# Altium schematic sheet Modulebit_004.SchDoc
size A2; Author: Steve Wiseman; Organization: Arbury.com Ltd; Address1: 2 Durnford Way; Address2: Cambridge; Address3: CB4 2DP; Address4: Unted Kingdom; DocumentNumber: 1; SheetNumber: 1; SheetTotal: 1
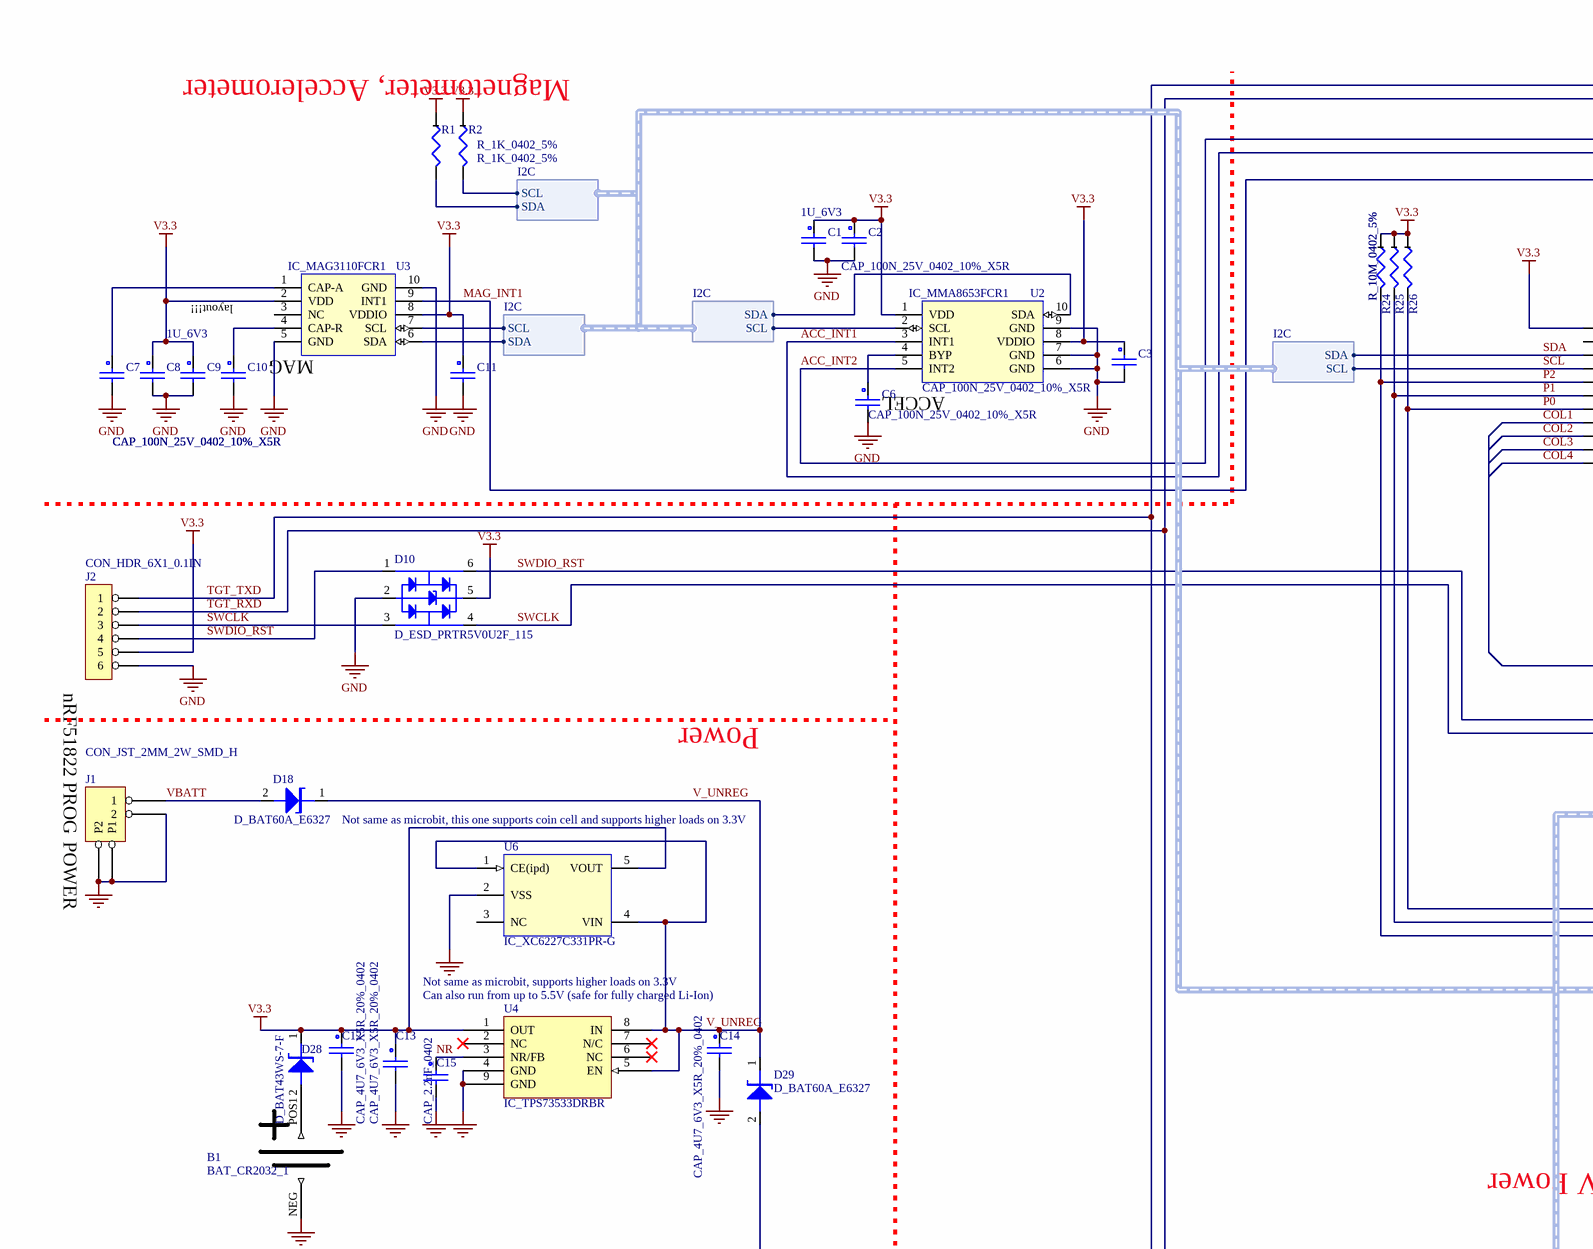
[diagram p0: Modulebit_004.SchDoc, top left]
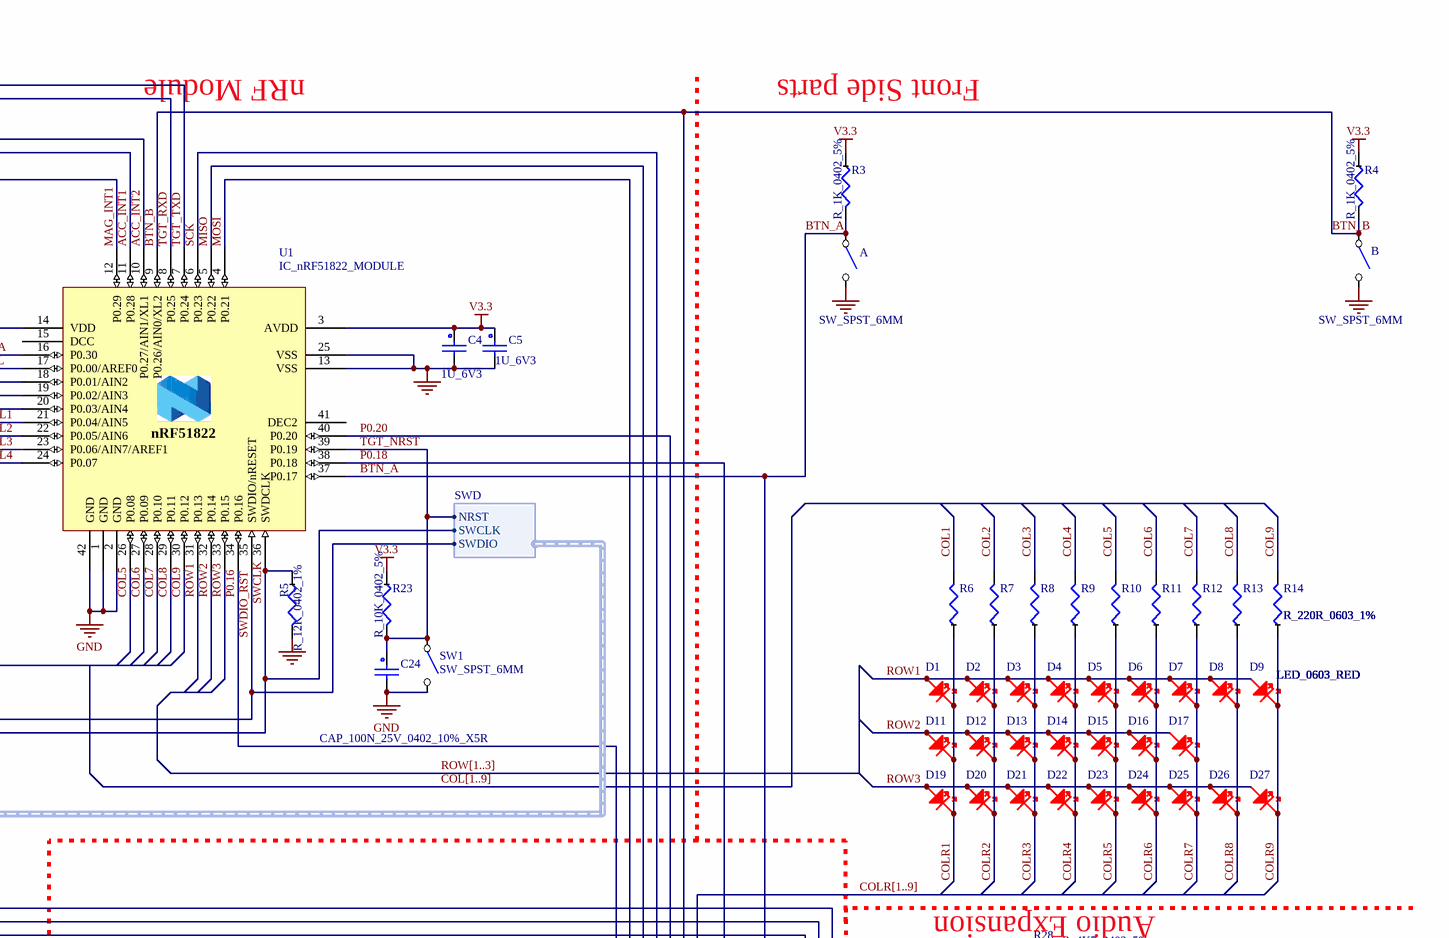
[diagram p1: Modulebit_004.SchDoc, top right]
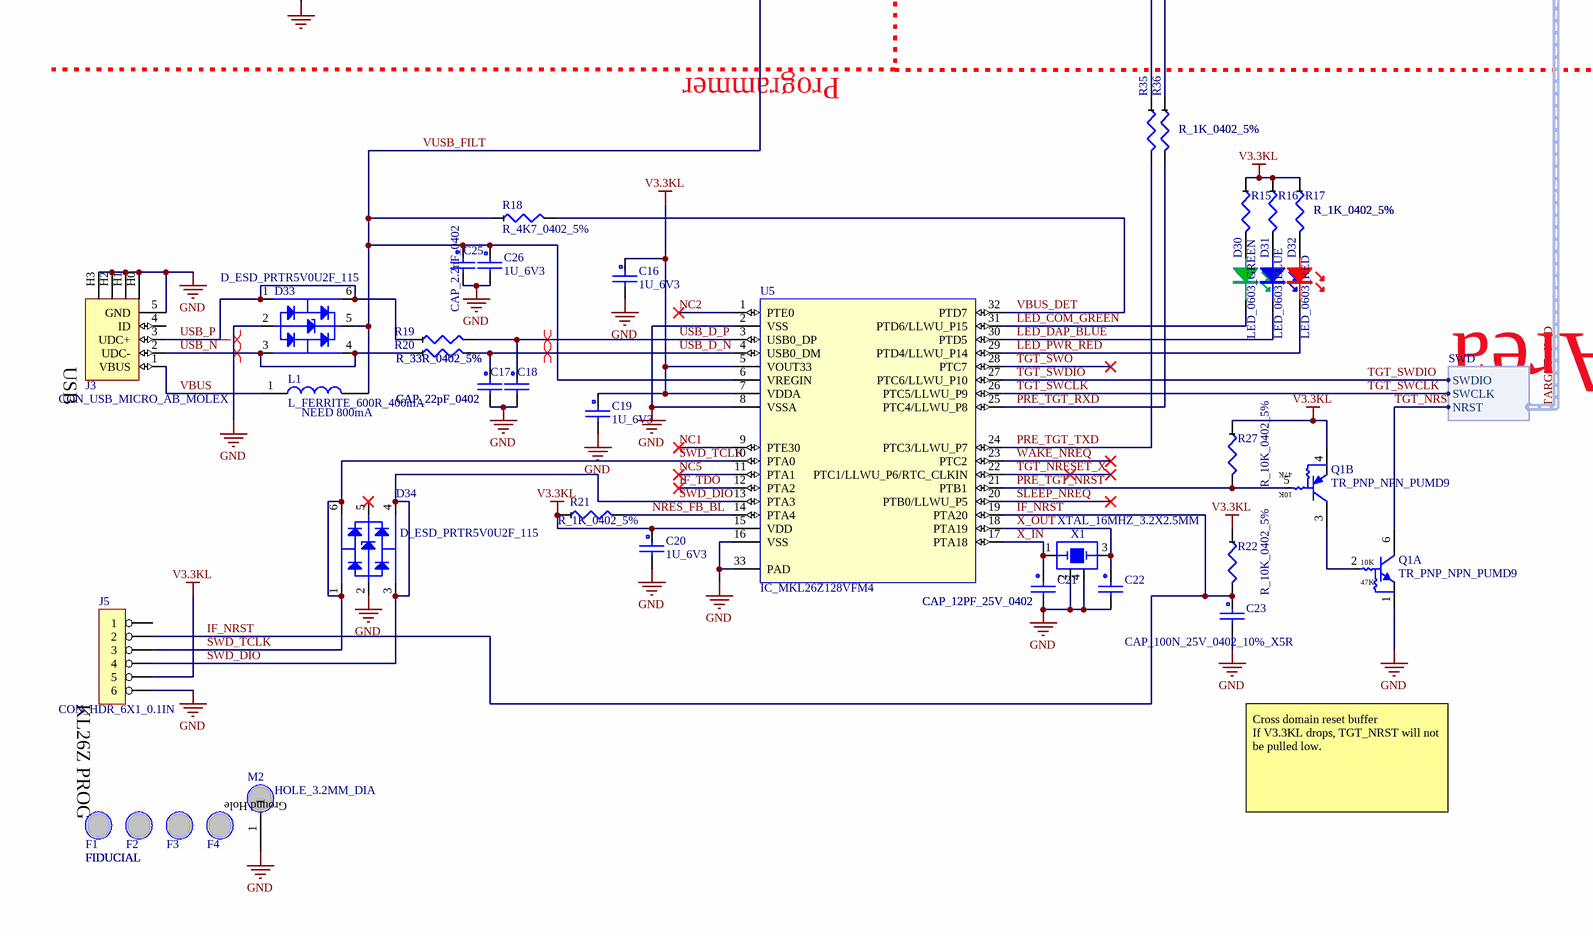
[diagram p2: Modulebit_004.SchDoc, bottom left]
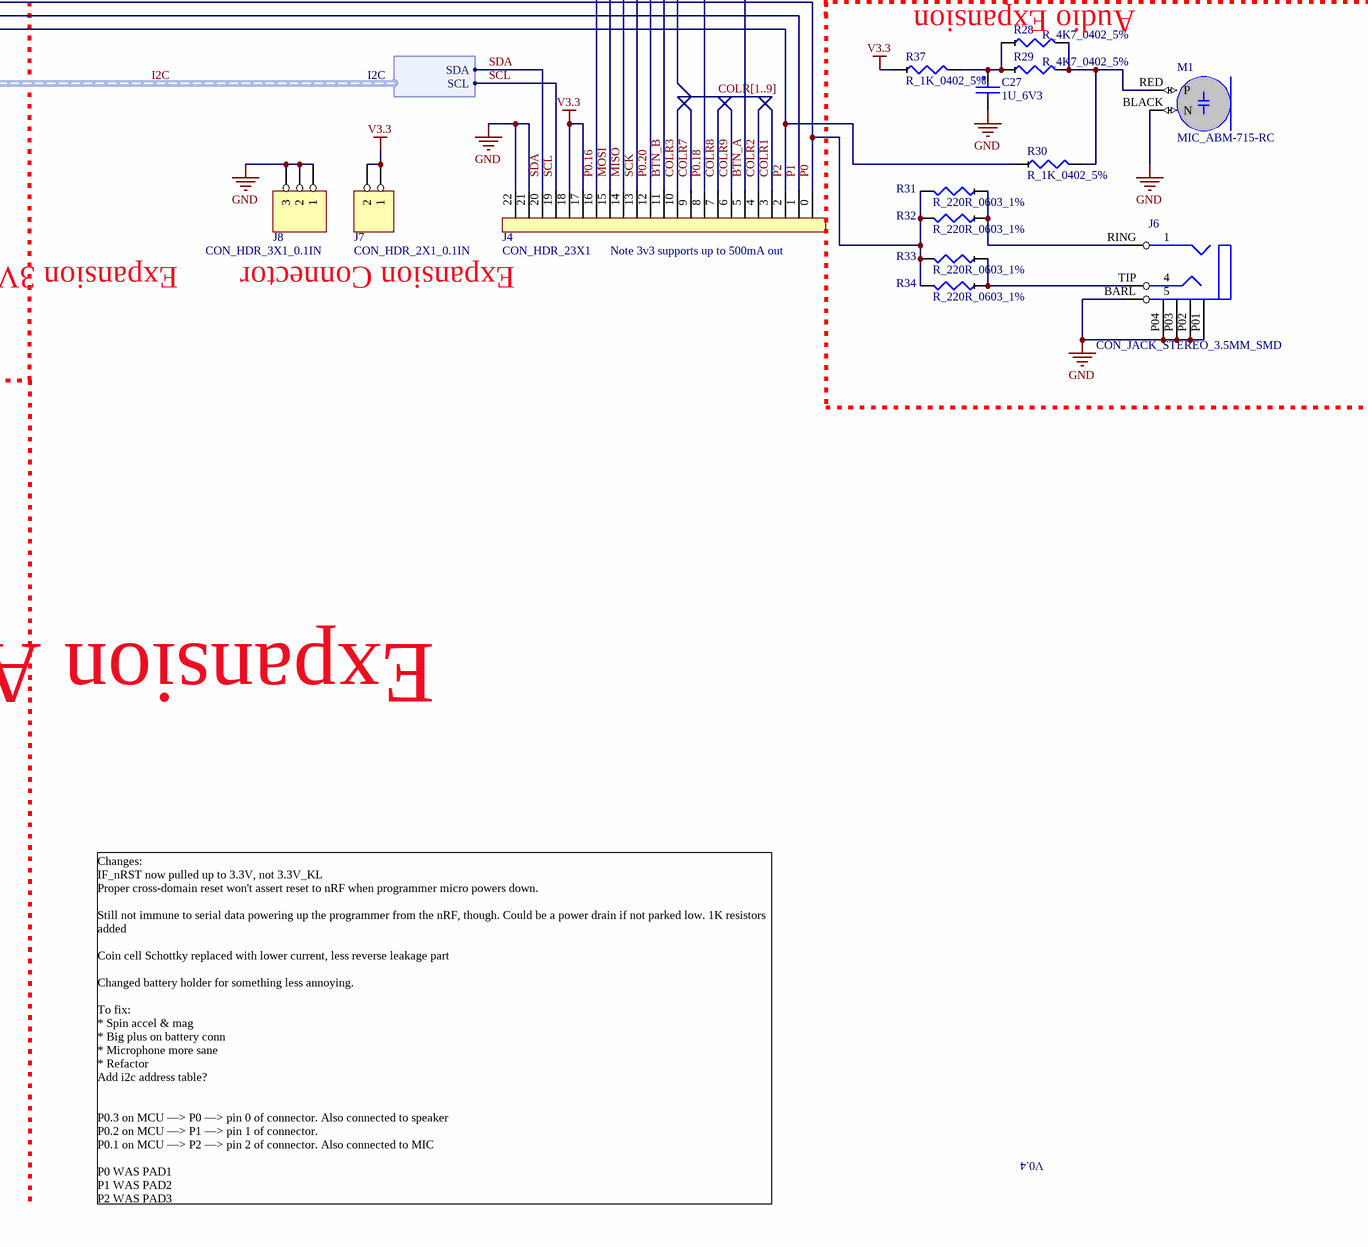
[diagram p3: Modulebit_004.SchDoc, bottom right]

## Parts
A  SW_SPST_6MM  [SW_FSM4JSMA]
B  SW_SPST_6MM  [SW_FSM4JSMA]
B1  BAT_CR2032_1  [BAT_CR2032_CH7410-2032LF]
C1  1U_6V3  [C_0402]
C2  CAP_100N_25V_0402_10%_X5R  [C_0402]
C3  CAP_100N_25V_0402_10%_X5R  [C_0402]
C4  1U_6V3  [C_0402]
C5  1U_6V3  [C_0402]
C6  CAP_100N_25V_0402_10%_X5R  [C_0402]
C7  CAP_100N_25V_0402_10%_X5R  [C_0402]
C8  1U_6V3  [C_0402]
C9  CAP_100N_25V_0402_10%_X5R  [C_0402]
C10  CAP_100N_25V_0402_10%_X5R  [C_0402]
C11  CAP_100N_25V_0402_10%_X5R  [C_0402]
C12  CAP_4U7_6V3_X5R_20%_0402  [c_0402]
C13  CAP_4U7_6V3_X5R_20%_0402  [c_0402]
C14  CAP_4U7_6V3_X5R_20%_0402  [c_0402]
C15  CAP_2.2nF_0402  [C_0402]
C16  1U_6V3  [C_0402]
C17  CAP_22pF_0402  [c_0402]
C18  CAP_22pF_0402  [c_0402]
C19  1U_6V3  [C_0402]
C20  1U_6V3  [C_0402]
C21  CAP_12PF_25V_0402  [C_0402]
C22  CAP_12PF_25V_0402  [C_0402]
C23  CAP_100N_25V_0402_10%_X5R  [C_0402]
C24  CAP_100N_25V_0402_10%_X5R  [C_0402]
C25  CAP_2.2nF_0402  [C_0402]
C26  1U_6V3  [C_0402]
C27  1U_6V3  [C_0402]
D1  LED_0603_RED  [LED_0603_RED]
D2  LED_0603_RED  [LED_0603_RED]
D3  LED_0603_RED  [LED_0603_RED]
D4  LED_0603_RED  [LED_0603_RED]
D5  LED_0603_RED  [LED_0603_RED]
D6  LED_0603_RED  [LED_0603_RED]
D7  LED_0603_RED  [LED_0603_RED]
D8  LED_0603_RED  [LED_0603_RED]
D9  LED_0603_RED  [LED_0603_RED]
D10  D_ESD_PRTR5V0U2F_115  [SOT886]
D11  LED_0603_RED  [LED_0603_RED]
D12  LED_0603_RED  [LED_0603_RED]
D13  LED_0603_RED  [LED_0603_RED]
D14  LED_0603_RED  [LED_0603_RED]
D15  LED_0603_RED  [LED_0603_RED]
D16  LED_0603_RED  [LED_0603_RED]
D17  LED_0603_RED  [LED_0603_RED]
D18  D_BAT60A_E6327  [SOD323]
D19  LED_0603_RED  [LED_0603_RED]
D20  LED_0603_RED  [LED_0603_RED]
D21  LED_0603_RED  [LED_0603_RED]
D22  LED_0603_RED  [LED_0603_RED]
D23  LED_0603_RED  [LED_0603_RED]
D24  LED_0603_RED  [LED_0603_RED]
D25  LED_0603_RED  [LED_0603_RED]
D26  LED_0603_RED  [LED_0603_RED]
D27  LED_0603_RED  [LED_0603_RED]
D28  D_BAT43WS-7-F  [SOD323]
D29  D_BAT60A_E6327  [SOD323]
D30  LED_0603_GREEN  [LED_0603_GREEN]
D31  LED_0603_BLUE  [LED_0603_BLUE]
D32  LED_0603_RED  [LED_0603_RED]
D33  D_ESD_PRTR5V0U2F_115  [SOT886]
D34  D_ESD_PRTR5V0U2F_115  [SOT886]
F1  FIDUCIAL  [FIDUCIAL_OV]
F2  FIDUCIAL  [FIDUCIAL_OV]
F3  FIDUCIAL  [FIDUCIAL_OV]
F4  FIDUCIAL  [FIDUCIAL_OV]
J1  CON_JST_2MM_2W_SMD_H  [CON_JST_S2B-PH-SM4-TB]
J2  CON_HDR_6X1_0.1IN  [CON_HDR_6X1]
J3  CON_USB_MICRO_AB_MOLEX  [CON_USB_MICRO_AB_MOLEX]
J4  CON_HDR_23X1  [CON_HDR_23X1]
J5  CON_HDR_6X1_0.1IN  [CON_HDR_6X1]
J6  CON_JACK_STEREO_3.5MM_SMD  [CON_JACK_STEREO_3.5MM_SMT]
J7  CON_HDR_2X1_0.1IN  [CON_HDR_2X1]
J8  CON_HDR_3X1_0.1IN  [CON_HDR_3X1]
L1  L_FERRITE_600R_400mA  [L_0603]
M1  MIC_ABM-715-RC  [MIC_ABM-715-RC]
M2  HOLE_3.2MM_DIA  [HOLE_3.2MM_DIA]  (no BOM)
Q1  TR_PNP_NPN_PUMD9  [SOT363_N]  (parts A,B of 2)
R1  R_1K_0402_5%  [R_0402]
R2  R_1K_0402_5%  [R_0402]
R3  R_1K_0402_5%  [R_0402]
R4  R_1K_0402_5%  [R_0402]
R5  R_12K_0402_1%  [R_0402]
R6  R_220R_0603_1%  [R_0603]
R7  R_220R_0603_1%  [R_0603]
R8  R_220R_0603_1%  [R_0603]
R9  R_220R_0603_1%  [R_0603]
R10  R_220R_0603_1%  [R_0603]
R11  R_220R_0603_1%  [R_0603]
R12  R_220R_0603_1%  [R_0603]
R13  R_220R_0603_1%  [R_0603]
R14  R_220R_0603_1%  [R_0603]
R15  R_1K_0402_5%  [R_0402]
R16  R_1K_0402_5%  [R_0402]
R17  R_1K_0402_5%  [R_0402]
R18  R_4K7_0402_5%  [R_0402]
R19  R_33R_0402_5%  [R_0402]
R20  R_33R_0402_5%  [R_0402]
R21  R_1K_0402_5%  [R_0402]
R22  R_10K_0402_5%  [R_0402]
R23  R_10K_0402_5%  [R_0402]
R24  R_10M_0402_5%  [R_0402]
R25  R_10M_0402_5%  [R_0402]
R26  R_10M_0402_5%  [R_0402]
R27  R_10K_0402_5%  [R_0402]
R28  R_4K7_0402_5%  [R_0402]
R29  R_4K7_0402_5%  [R_0402]
R30  R_1K_0402_5%  [R_0402]
R31  R_220R_0603_1%  [R_0603]
R32  R_220R_0603_1%  [R_0603]
R33  R_220R_0603_1%  [R_0603]
R34  R_220R_0603_1%  [R_0603]
R35  R_1K_0402_5%  [R_0402]
R36  R_1K_0402_5%  [R_0402]
R37  R_1K_0402_5%  [R_0402]
SW1  SW_SPST_6MM  [SW_FSM4JSMA]
U1  IC_nRF51822_MODULE  [IC_nRF51822_MODULE_PASTE]
U2  IC_MMA8653FCR1  [IC_QFN40P200X200X85-10M]
U3  IC_MAG3110FCR1  [IC_QFN40P200X200X85-10M]
U4  IC_TPS73533DRBR  [IC_QFN65P300X300X100-8M-TI]
U5  IC_MKL26Z128VFM4  [IC_QFN50P500X500X100-32N]
U6  IC_XC6227C331PR-G  [SOT895]
X1  XTAL_16MHZ_3.2X2.5MM  [XTAL_3.2X2.5MM]

## Harnesses
SWD: SWDIO, SWCLK, NRST
I2C: SCL, SDA

## Nets
GND: A.2 B.2 B1.NEG C1.2 C2.2 C3.2 C4.2 C5.2 C6.2 C7.2 C8.2 C9.2 C10.2 C11.2 C12.2 C13.2 C14.2 C15.2 C16.2 C17.2 C18.2 C19.2 C20.2 C21.2 C22.2 C23.2 C24.2 C25.2 C26.2 C27.2 D10.2 D33.2 D34.2 J1.2 J1.P1 J1.P2 J2.6 J3.5(GND) J3.H0 J3.H1 J3.H2 J3.H3 J4.21 J4.22 J5.6 J6.BARL J6.P01 J6.P02 J6.P03 J6.P04 J8.1 J8.2 J8.3 M1.BLACK(N) M2.1 Q1.1(E) R5.2 SW1.2 U1.1(GND) U1.2(GND) U1.13(VSS) U1.25(VSS) U1.42(GND) U2.6(GND) U2.7(GND) U2.9(GND) U3.5(GND) U3.10(GND) U4.4(GND) U4.9(GND) U5.2(VSS) U5.8(VSSA) U5.16(VSS) U5.33(PAD) U6.2(VSS) X1.2(G2) X1.4(G4)
V3.3: C1.1 C2.1 C3.1 C4.1 C5.1 C8.1 C9.1 C11.1 C12.1 C13.1 D10.5 D28.1(K) J2.5 J4.17 J4.18 J7.1 J7.2 R1.1 R2.1 R3.1 R4.1 R23.1 R24.1 R25.1 R26.1 R37.1 U1.3(AVDD) U1.14(VDD) U2.1(VDD) U2.8(VDDIO) U3.2(VDD) U3.8(VDDIO) U4.1(OUT) U6.5(VOUT)
V3.3KL: C16.1 C19.1 C20.1 J5.5 Q1.4(E) R15.1 R16.1 R17.1 R21.1 R22.1 R27.1 U5.5(VOUT33) U5.7(VDDA) U5.15(VDD)
ACC_INT1: U1.11(P0.28) U2.3(INT1)
ACC_INT2: U1.10(P0.27/AIN1/XL1) U2.5(INT2)
BTN_A: A.1 J4.5 R3.2 U1.37(P0.17)
BTN_B: B.1 J4.11 R4.2 U1.9(P0.26/AIN0/XL2)
COL1: R6.2 U1.21(P0.04/AIN5)
COL2: R7.2 U1.22(P0.05/AIN6)
COL3: R8.2 U1.23(P0.06/AIN7/AREF1)
COL4: R9.2 U1.24(P0.07)
COL5: R10.2 U1.26(P0.08)
COL6: R11.2 U1.27(P0.09)
COL7: R12.2 U1.28(P0.10)
COL8: R13.2 U1.29(P0.11)
COL9: R14.2 U1.30(P0.12)
COLR1: D1.K D11.K D19.K J4.3 R6.1
COLR2: D2.K D12.K D20.K J4.4 R7.1
COLR3: D3.K D13.K D21.K J4.10 R8.1
COLR4: D4.K D14.K D22.K R9.1
COLR5: D5.K D15.K D23.K R10.1
COLR6: D6.K D16.K D24.K R11.1
COLR7: D7.K D17.K D25.K J4.9 R12.1
COLR8: D8.K D26.K J4.7 R13.1
COLR9: D9.K D27.K J4.6 R14.1
IF_NRST: C23.1 J5.2 R22.2 U5.19(PTA20)
IF_TDO: U5.12(PTA2)
LED_COM_GREEN: D30.K U5.31(PTD6/LLWU_P15)
LED_DAP_BLUE: D31.K U5.30(PTD5)
LED_PWR_RED: D32.K U5.29(PTD4/LLWU_P14)
MAG_INT1: U1.12(P0.29) U3.9(INT1)
MISO: J4.14 U1.5(P0.22)
MOSI: J4.15 U1.4(P0.21)
NC1: U5.9(PTE30)
NC2: U5.1(PTE0)
NC5: U5.11(PTA1)
NR: C15.1 U4.3(NR/FB)
NRES_FB_BL: R21.2 U5.14(PTA4)
P0: J4.0 R26.2 R31.2 R32.2 R33.2 R34.2 U1.20(P0.03/AIN4)
P0.16: J4.16 U1.34(P0.16)
P0.18: J4.8 U1.38(P0.18)
P0.20: J4.12 U1.40(P0.20)
P1: J4.1 R25.2 U1.19(P0.02/AIN3)
P2: J4.2 R24.2 R30.1 U1.18(P0.01/AIN2)
PRE_TGT_NRST: Q1.5(B) R27.2 U5.21(PTB1)
PRE_TGT_RXD: R36.2 U5.25(PTC4/LLWU_P8)
PRE_TGT_TXD: R35.2 U5.24(PTC3/LLWU_P7)
ROW1: D1.A D2.A D3.A D4.A D5.A D6.A D7.A D8.A D9.A U1.31(P0.13)
ROW2: D11.A D12.A D13.A D14.A D15.A D16.A D17.A U1.32(P0.14)
ROW3: D19.A D20.A D21.A D22.A D23.A D24.A D25.A D26.A D27.A U1.33(P0.15)
SCK: J4.13 U1.6(P0.23)
SCL: J4.19 R2.2 U1.17(P0.00/AREF0) U2.2(SCL) U3.7(SCL) ; harness I2C.SCL  [project net I2C.SCL]
SDA: J4.20 R1.2 U1.16(P0.30) U2.10(SDA) U3.6(SDA) ; harness I2C.SDA  [project net I2C.SDA]
SLEEP_NREQ: U5.20(PTB0/LLWU_P5)
SWCLK: D10.3 D10.4 J2.3 R5.1 U1.36(SWDCLK) U5.26(PTC5/LLWU_P9) ; harness SWD.SWCLK  [also labelled TGT_SWCLK]
SWD_DIO: D34.3 D34.4 J5.4 U5.13(PTA3)
SWD_TCLK: D34.1 D34.6 J5.3 U5.10(PTA0)
SWDIO_RST: D10.1 D10.6 J2.4 U1.35(SWDIO/nRESET) U5.27(PTC6/LLWU_P10) ; harness SWD.SWDIO  [also labelled TGT_SWDIO]
TGT_NRESET_X: U5.22(PTC1/LLWU_P6/RTC_CLKIN)
TGT_NRST: C24.1 Q1.6(C) R23.2 SW1.1 U1.39(P0.19) ; harness SWD.NRST  [project net TARGET_SWD.NRST]
TGT_RXD: J2.2 R36.1 U1.8(P0.25)
TGT_SWO: U5.28(PTC7)
TGT_TXD: J2.1 R35.1 U1.7(P0.24)
USB_D_N: C17.1 R20.2 U5.4(USB0_DM)
USB_D_P: C18.1 R19.2 U5.3(USB0_DP)
USB_N: D33.3 D33.4 J3.2(UDC-) R20.1
USB_P: D33.1 D33.6 J3.3(UDC+) R19.1
V_UNREG: C14.1 D18.1(K) D29.1(K) U4.5(EN) U4.8(IN) U6.1(CE(ipd)) U6.4(VIN)
VBATT: D18.2(A) J1.1
VBUS: J3.1(VBUS) L1.1
VBUS_DET: R18.2 U5.32(PTD7)
VUSB_FILT: C25.1 C26.1 D29.2(A) D33.5 L1.2 R18.1 U5.6(VREGIN)
WAKE_NREQ: U5.23(PTC2)
X_IN: C21.1 U5.17(PTA18) X1.1(X1)
X_OUT: C22.1 U5.18(PTA19) X1.3(X3)
NetB1_POS1: B1.POS1 D28.2(A)
NetC6_1: C6.1 U2.4(BYP)
NetC7_1: C7.1 U3.1(CAP-A)
NetC10_1: C10.1 U3.4(CAP-R)
NetC27_1: C27.1 R28.1 R29.1 R37.2
NetD30_A: D30.A R15.2
NetD31_A: D31.A R16.2
NetD32_A: D32.A R17.2
NetJ6_RING: J6.RING R31.1 R32.1
NetJ6_TIP: J6.TIP R33.1 R34.1
NetM1_RED: M1.RED(P) R28.2 R29.2 R30.2
NetQ1_2: Q1.2(B) Q1.3(C)

Not connected (* = marked no-connect by the designer): D34 5*; F1 1; F2 1; F3 1; F4 1; J3 4(ID); J5 1; U1 15(DCC) 41(DEC2); U3 3(NC); U4 2(NC)* 6(NC)* 7(N/C)*; U6 3(NC)

## Buses and harness runs
bus COL[1..9]
bus COLR[1..9]
bus ROW[1..3]

## Layout directives
differential pair: USB_D_N, USB_D_P, USB_N, USB_P

## Notes on the sheet
- Magnetometer, Accelerometer
- nRF Module
- Front Side parts
- (near U3) layout!!!
- (near U3) MAG
- (near U2) ACCEL
- (near J2) nRF51822 PROG
- Power
- Not same as microbit, this one supports coin cell and supports higher loads on 3.3V
- (near J1) POWER
- Audio Expansion
- Not same as microbit, supports higher loads on 3.3V
- Can also run from up to 5.5V (safe for fully charged Li-Ion)
- Expansion 3V Power
- (near J4) Expansion Connector
- (near J4) Note 3v3 supports up to 500mA out
- Programmer
- Expansion Area
- (near J3) USB
- (near L1) NEED 800mA
- (near J5) KL26Z PROG
- (near M2) Ground Hole
- Cross domain reset buffer
  If V3.3KL drops, TGT_NRST will not be pulled low.
- Changes:
  IF_nRST now pulled up to 3.3V, not 3.3V_KL
  Proper cross-domain reset won't assert reset to nRF when programmer micro powers down.
  Still not immune to serial data powering up the programmer from the nRF, though. Could be a power drain if not parked low. 1K resistors added
  Coin cell Schottky replaced with lower current, less reverse leakage part
  Changed battery holder for something less annoying.
  To fix:
  * Spin accel & mag
  * Big plus on battery conn
  * Microphone more sane
  * Refactor
  Add i2c address table?
  P0.3 on MCU —> P0 —> pin 0 of connector. Also connected to speaker
  P0.2 on MCU —> P1 —> pin 1 of connector.
  P0.1 on MCU —> P2 —> pin 2 of connector. Also connected to MIC
  P0 WAS PAD1
  P1 WAS PAD2
  P2 WAS PAD3
- V0.4
- Title
- Cambridge Prototypes Ltd
- Size:
- Date:
- File:
- A2
- Number:
- Time:
- Revision:
- Sheet
- of
- 2 Durnford Way
- Cambridge
- CB4 2DP
- (in symbol CON_JACK_STEREO_3.5MM_SMD) 1; 4; 5
- (in symbol IC_nRF51822_MODULE) nRF51822
- (in symbol TR_PNP_NPN_PUMD9, part A) 10K; 47K
- (in symbol TR_PNP_NPN_PUMD9, part B) 47K; 10K

## Library data of the parts
A B SW1 = SW_SPST_6MM: SPST SWITCH 6MM; PART: FSM4JSMA; MANUFACTURER: TE CONNECTIVITY / ALCOSWITCH; FARNELL: 3801305
B1 = BAT_CR2032_1: CR2032 battery in holder; PART: CH7410-2032LF; MANUFACTURER: Takachi Electric Industrial; RS: 239-592; FARNELL: 2064724
C1 C4 C5 C8 C16 C19 C20 C26 C27 = CAP_1u_6V3_0402_10%_X6S: MANUFACTURER: YAGEO; PART: CC0402KRX7R7BB104; FARNELL: 9402047RL; MOUSER: 603-CC402KRX7R7BB104; DIGIKEY: 311-1338-6-ND
C2 C3 C6 C7 C9-C11 C23 C24 = CAP_100N_25V_0402_10%_X5R: PART: TMK105BJ104KV-F; MANUFACTURER: TAIYO YUDEN; FARNELL: 1611916
C12-C14 = CAP_4U7_6V3_X5R_20%_0402: PART: C1005X5R0J475M; MANUFACTURER: TDK; FARNELL: 1962109
C15 C25 = CAP_2.2nF_0402: PART: GRM155R71H222KA01D; MANUFACTURER: MURATA; FARNELL: 1889208RL
C17 C18 = CAP_22pF_0402: CAP 0402 C0G 50V 22PF; PART: 04025A220JAT2A; MANUFACTURER: AVX; FARNELL: 1327634RL
D1-D9 D11-D17 D19-D27 = LED_0603_RED: LED RED 0603; PART: KP-1608SURC; MANUFACTURER: KINGBRIGHT; FARNELL: 8529868RL
D10 D33 D34 = D_ESD_PRTR5V0U2F_115: Ultra low capacitance double rail-to-rail ESD protection; MANUFACTURER: NXP; FARNELL: 2459738; PART: PRTR5V0U2F_115
D18 D29 = D_BAT60A_E6327: 3A Schottky diode with extreme low V  F drop (typ. 0.12V at IF = 10mA); MANUFACTURER: INFINEON; PART: BAT 60A E6327; FARNELL: 2432679RL
D28 = D_BAT43WS-7-F: Schottky 200mA 30V 0.5uA@25Vr; MANUFACTURER: Diodes Incorporated; RS: 751-3364P; FARNELL: 2305998; PART: BAT43WS-7-F; DIGIKEY: BAT43WS-FDICT-ND; MOUSER: 621-BAT43WS-F
D30 = LED_0603_GREEN: MANUFACTURER: KINGBRIGHT; PART: KP-3216CGCK; FARNELL: 2290333
D31 = LED_0603_BLUE: MANUFACTURER: MULTICOMP; FARNELL: 1716770RL; PART: OVS-0603
D32 = LED_0603_RED: LED RED 0603; MANUFACTURER: KINGBRIGHT; PART: KP-1608SURC; FARNELL: 8529868RL
F1-F4 = FIDUCIAL: FIDUCIAL - NO CONNECT; MANUFACTURER: PCB FEATURE; Text Field1: NOT A PART; NOFIT: *; FARNELL: NONE; PART: PCB FEATURE
J1 = CON_JST_2MM_2W_SMD_H: 2 PIN 2MM SMT JST  CONNECTOR; PART: S2B-PH-SM4-TB(LF)(SN); MANUFACTURER: JST; DIGIKEY: 455-1749-1-ND; FARNELL: 9492615
J2 = CON_HDR_6X1_0.1IN: 6 PIN HEADER; MANUFACTURER: TE; PART: 826629-6; FARNELL: 3418327
J3 = CON_USB_MICRO_AB_MOLEX: USB Micro-AB socket Molex 47589-0001; RS: 702-5488; Farnell: 156-8023; PART: 47589-0001; MANUFACTURER: Molex
J4 = CON_HDR_23X1: 0.1in HEADER STRIP 23X1; PART: TSW-123-07-T-S; MANUFACTURER: SAMTEC; FARNELL: 2035705
J5 = CON_HDR_6X1_0.1IN: 6 PIN HEADER; PART: 826629-6; MANUFACTURER: TE; FARNELL: 3418327
J6 = CON_JACK_STEREO_3.5MM_SMD: 3.5 MM STEREO SMT JACK SOCKET SMD; PART: 1503 03; MANUFACTURER: LUMBERG; FARNELL: 1216980
J7 = CON_HDR_2X1_0.1IN: 2 PIN HEADER; MANUFACTURER: TE CONNECTIVITY / AMP; PART: 825433-2; FARNELL: 3417645
J8 = CON_HDR_3X1_0.1IN: 3 PIN HEADER; MANUFACTURER: MOLEX; FARNELL: 9731083; PART: 22-03-2031
L1 = L_FERRITE_600R_400mA: FERRITE 600R 400mA 0.35R  IN 0603; MANUFACTURER: FAIR-RITE; PART: 2506036017Y0; FARNELL: 1653395RL
M1 = MIC_ABM-715-RC: PRO SIGNAL  ABM-715-RC  ELECTRET MICROPHONE OMNI LEADS; MANUFACTURER: PRO SIGNAL; FARNELL: 2066501; PART: ABM-715-RC
M2 = HOLE_3.2MM_DIA: HOLE, 3.2MM DIA FINISHED
Q1 = TR_PNP_NPN_PUMD9: NXP - PUMD9 - TRANSISTOR, DIGITAL, NPN+PNP SOT-363; PackageReference: SOT363; Code_IPC: SOT363-6; FARNELL: 2439782; PART: PUMD9; MANUFACTURER: NXP
R6-R14 R31-R34 = R_220R_0603_1%: Text Field1: 9330801; Text Field2: vnr160; Text Field3: Yes; Text Field4: 502-468-00-00-RES*-BP; FARNELL_ROHS: *
R18 R28 R29 = R_4K7_0402_5%: Text Field1: 3898635; FARNELL_ROHS: *
R19 R20 = R_33R_0402_5%: Text Field1: 3898507; FARNELL_ROHS: *
R24-R26 = R_10M_0402_5%: PART: RC0603FR-0710ML; MANUFACTURER: YAGEO; FARNELL: 9238964RL
U1 = IC_nRF51822_MODULE: RF System on a Chip - SoC 2.4GHz BT low Energy 256KB Flash 16KB Ram; MANUFACTURER: RAYTAC; PART: MDBT40-256V3; FARNELL: ???
U2 = IC_MMA8653FCR1: 3-Axis 10-bit Digital  Accelerometer; MANUFACTURER: FREESCALE; RS: 801-6882; PART: MMA8653FCR1
U3 = IC_MAG3110FCR1: Three-Axis Digital  Magnetometer; MANUFACTURER: FREESCALE; RS: 750-0835; PART: MAG3110FCR1
U4 = IC_TPS73533DRBR: TPS735 500-mA 3V3, Low Quiescent Current, Ultra-Low Noise, High PSRR,  Low-Dropout Linear Regulator; MANUFACTURER: TI; PART: TPS73533DRBR; DIGIKEY: 296-39485-1-ND; FARNELL: 2075415; MOUSER: 595-TPS73533DRBR
U5 = IC_MKL26Z128VFM4: 32bit ARM Cortex M0+ Microcontroller 48MHz 128 kB Flash 32-Pin QFN; MANUFACTURER: NXP; RS: 818-1255; PART: MKL26Z128VFM4
U6 = IC_XC6227C331PR-G: Linear Voltage Regulator IC Positive Fixed 1 Output 3.3V 700mA SOT-89-5; MANUFACTURER: TOREX; PART: XC6227C331PR-G; DIGIKEY: 893-1175-1-ND
X1 = XTAL_16MHZ_3.2X2.5MM: CRYSTAL 16MHZ 20PF_3.2X2.5MM; MANUFACTURER: CTS-Frequency Controls; PART: 403C11E16M00000; DIGIKEY: CTX732CT-ND
C21 C22 = CAP_12PF_25V_0402: FARNELL: 1414576
R1-R4 R15-R17 R21 R30 R35-R37 = R_1K_0402_5%: FARNELL_ROHS: *; FARNELL: 1358043
R5 = R_12K_0402_1%: FARNELL_ROHS: 2447104RL; FARNELL: 2447104RL
R22 R23 R27 = R_10K_0402_5%: FARNELL_ROHS: *; FARNELL: 1358069